# EAGLE design CPU_BOARD (EAGLE 7.3.0)
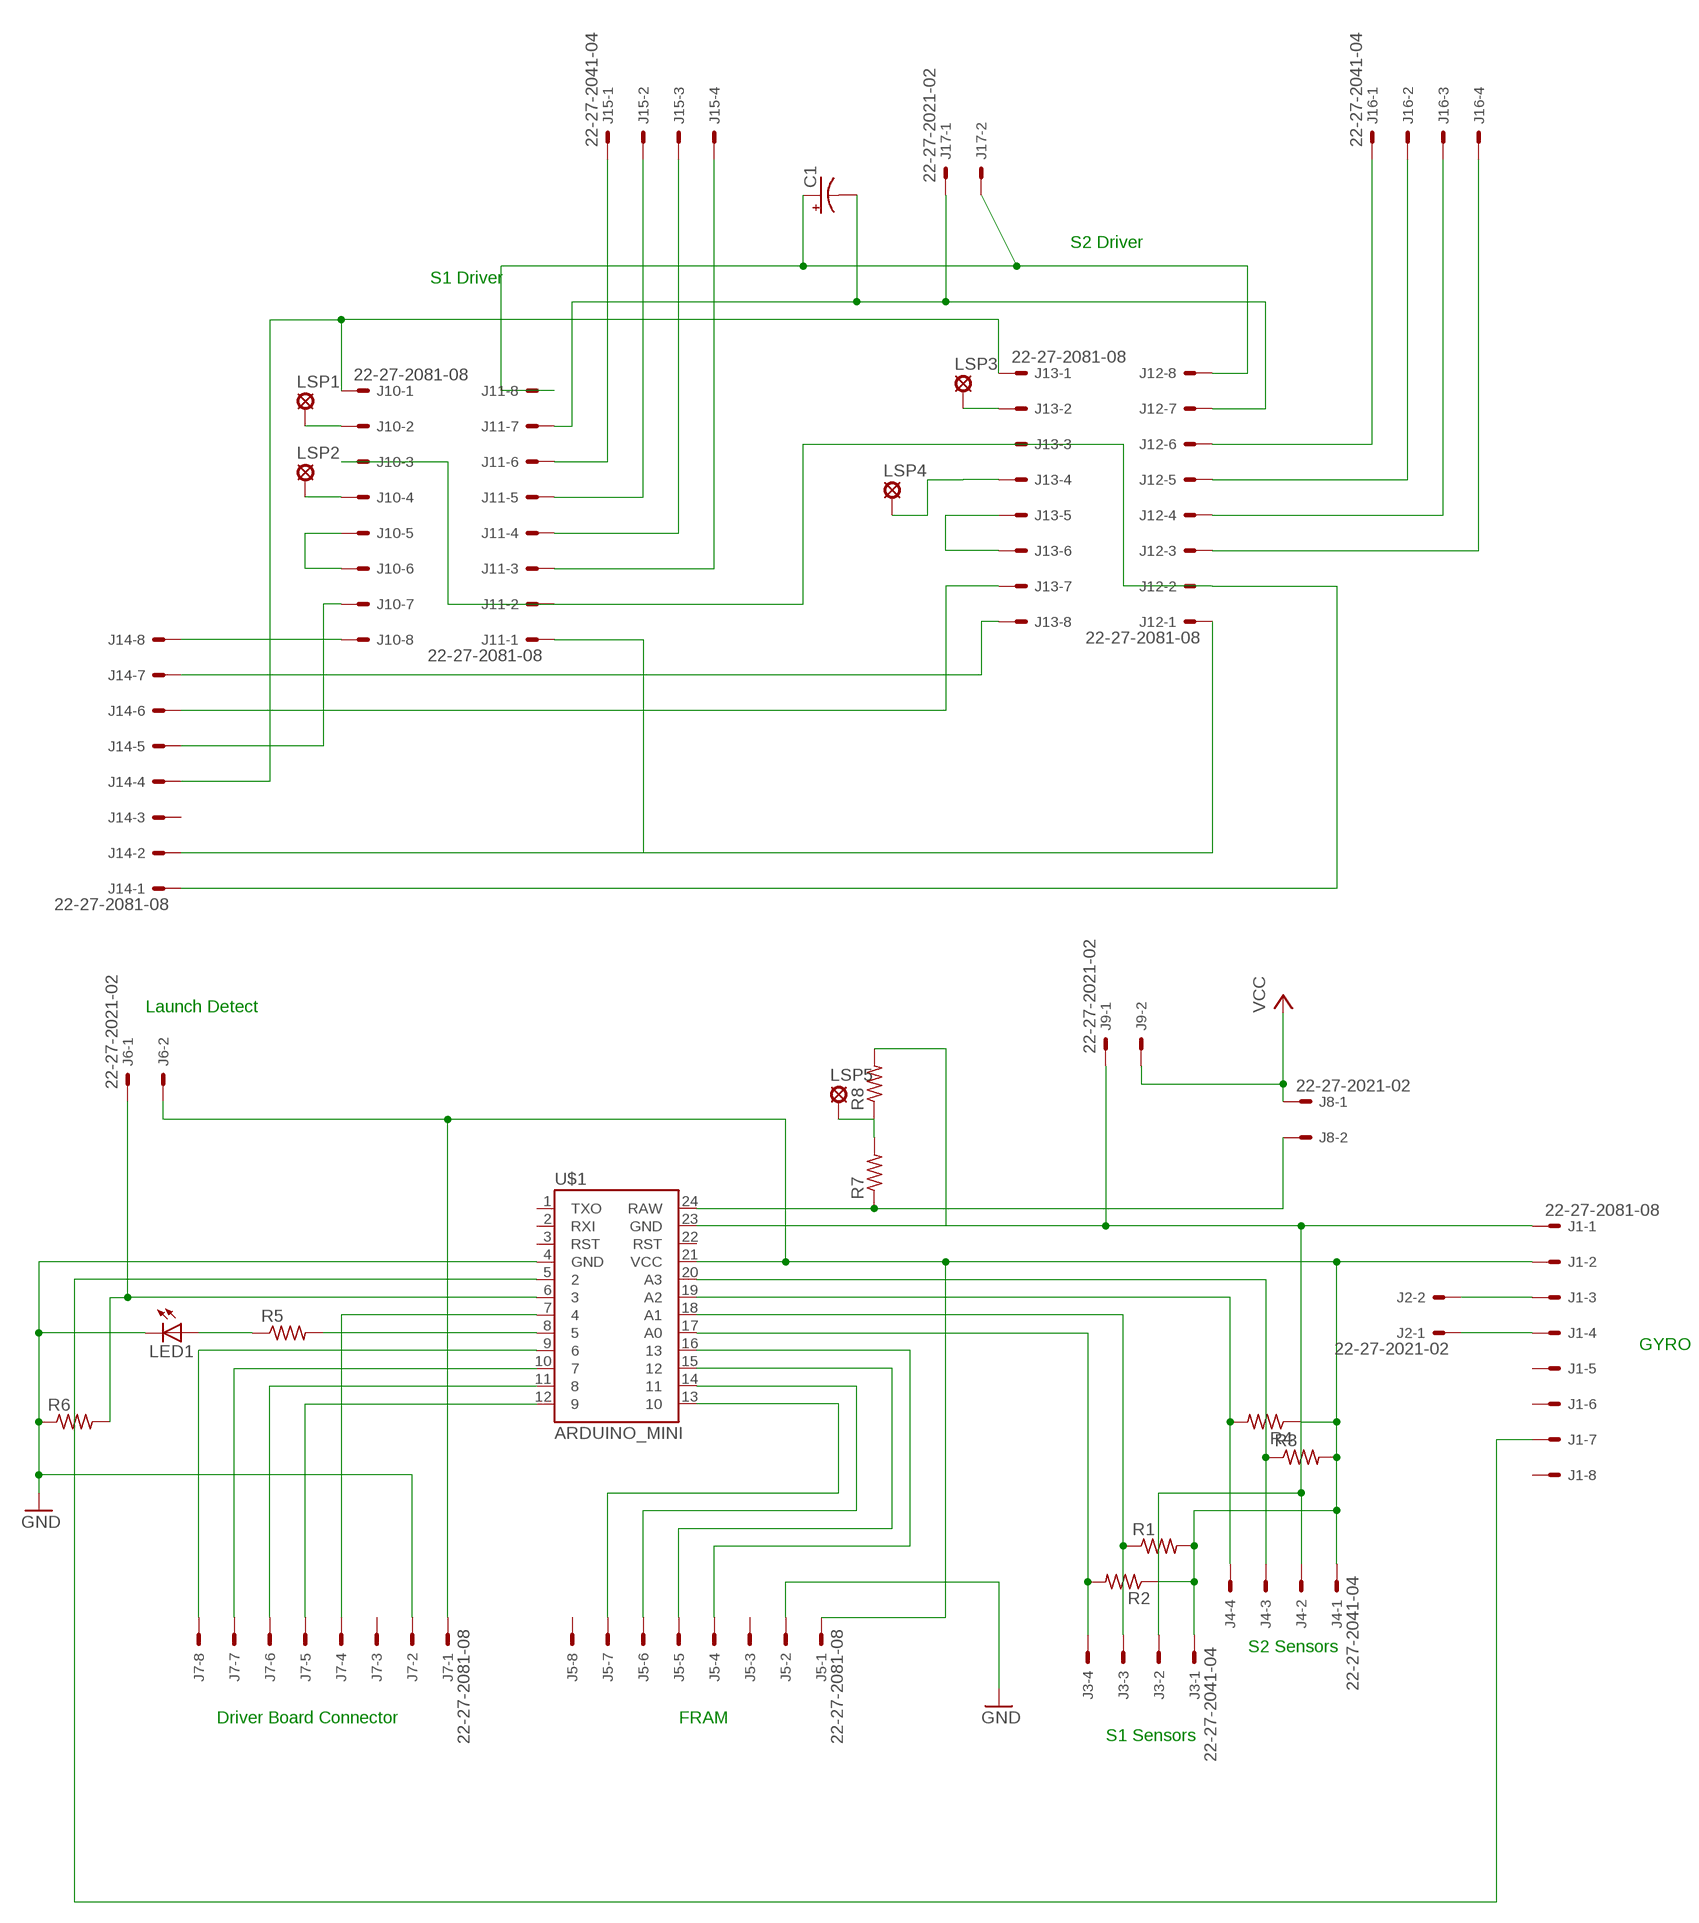
[diagram p0: schematic, sheet 1]

## Parts
C1  CPOL-USE2.5-7  [E2,5-7]
J1  22-27-2081-08  [6410-08]
J2  22-27-2021-02  [6410-02]
J3  22-27-2041-04  [6410-04]
J4  22-27-2041-04  [6410-04]
J5  22-27-2081-08  [6410-08]
J6  22-27-2021-02  [6410-02]
J7  22-27-2081-08  [6410-08]
J8  22-27-2021-02  [6410-02]
J9  22-27-2021-02  [6410-02]
J10  22-27-2081-08  [6410-08]
J11  22-27-2081-08  [6410-08]
J12  22-27-2081-08  [6410-08]
J13  22-27-2081-08  [6410-08]
J14  22-27-2081-08  [6410-08]
J15  22-27-2041-04  [6410-04]
J16  22-27-2041-04  [6410-04]
J17  22-27-2021-02  [6410-02]
LED1  LED5MM  [LED5MM]
LSP1  LSP10  [LSP10]
LSP2  LSP10  [LSP10]
LSP3  LSP10  [LSP10]
LSP4  LSP10  [LSP10]
LSP5  LSP11  [LSP11]
R1  R-US_0204/5  [0204/5]
R2  R-US_0204/5  [0204/5]
R3  R-US_0204/5  [0204/5]
R4  R-US_0204/5  [0204/5]
R5  R-US_0204/5  [0204/5]
R6  R-US_0204/5  [0204/5]
R7  R-US_0204/5  [0204/5]
R8  R-US_0204/5  [0204/5]
U$1  ARDUINO_MINI  [ARDUINO_MINI]

## Nets
GND: J5.2 J7.2 LED1.K(C) R6.1 U$1.4(GND)
N$1: J1.3 J2.2
N$2: J1.4 J2.1
N$3: J1.2 J3.1 J4.1 J5.1 J6.2 J7.1 R1.2 R2.1 R3.2 R4.1 U$1.21(VCC)
N$4: J10.5 J10.6
N$5: J8.2 R7.1 U$1.24(RAW)
N$6: J1.7 U$1.5
N$7: J5.7 U$1.13
N$8: J5.6 U$1.14
N$9: J4.3 R3.1 U$1.20(A3)
N$10: J4.4 R4.2 U$1.19(A2)
N$11: J3.3 R1.1 U$1.18(A1)
N$12: J3.4 R2.2 U$1.17(A0)
N$13: J5.5 U$1.15
N$14: J5.4 U$1.16
N$15: R5.2 U$1.8
N$16: LED1.A R5.1
N$17: J6.1 R6.2 U$1.6
N$18: J7.8 U$1.9
N$19: J13.5 J13.6
N$20: J7.7 U$1.10
N$21: J7.6 U$1.11
N$22: J7.5 U$1.12
N$23: J7.4 U$1.7
N$24: J1.1 J3.2 J4.2 J9.1 R8.2 U$1.23(GND)
N$25: J10.4 LSP2.MP
N$26: J10.8 J14.8
N$27: J10.7 J14.5
N$28: J13.7 J14.6
N$29: J13.8 J14.7
N$30: J10.2 LSP1.MP
N$31: C1.+ J11.8 J12.8 J17.2
N$32: J10.3 J11.2 J12.2 J13.3 J14.1
N$33: J11.1 J12.1 J14.2
N$34: C1.- J11.7 J12.7 J17.1
N$35: J10.1 J13.1 J14.4
N$36: J13.4 LSP4.MP
N$37: J11.6 J15.1
N$38: J11.5 J15.2
N$39: J11.4 J15.3
N$40: J11.3 J15.4
N$41: J12.6 J16.1
N$42: J12.5 J16.2
N$43: J12.4 J16.3
N$44: J12.3 J16.4
N$45: J13.2 LSP3.MP
N$47: LSP5.MP R7.2 R8.1
VCC: J8.1 J9.2
Unconnected: J1.5 J1.6 J1.8 J5.3 J5.8 J7.3 J14.3 U$1.1(TXO) U$1.2(RXI) U$1.3(RST) U$1.22(RST)

## Notes on the sheet
- S2 Driver
- S1 Driver
- Launch Detect
- GYRO
- S2 Sensors
- Driver Board Connector | FRAM
- S1 Sensors

## Library data of the parts
C1 = resistor:CPOL-US: POLARIZED CAPACITOR, American symbol
J1 J5 J7 J10-J14 = con-molex:22-?-08: CONNECTOR wire to board 2.54 mm (.1 inch) pitch header; OC_FARNELL: unknown; OC_NEWARK: unknown
J2 J6 J8 J9 J17 = con-molex:22-?-02: CONNECTOR wire to board 2.54 mm (.1 inch) pitch header; OC_FARNELL: unknown; OC_NEWARK: unknown
J3 J4 J15 J16 = con-molex:22-?-04: CONNECTOR wire to board 2.54 mm (.1 inch) pitch header; OC_FARNELL: unknown; OC_NEWARK: unknown
LED1 = led:LED: LED OSRAM: - CHIPLED LG R971, LG N971, LY N971, LG Q971, LY Q971, LO R971, LY R971 LH N974, LH R974 LS Q976, LO Q976, LY Q976 LO Q996 - Hyper CHIPLED LW Q18S LB Q993, LB Q99A, LB R99A - SideLED LS A670, LO A670, LY A670, LG A670, LP A670 LB A673, LV A673, LT A673, LW A673 LH A674 LY A675 LS A676, LA A676, LO A676, LY A676, LW A676 LS A679, LY A679, LG A679 - Hyper Micro SIDELED® LS Y876, LA Y876, LO Y876, LY Y876 LT Y87S - SmartLED LW L88C, LW L88S LB L89C, LB L89S, LG L890 LS L89K, LO L89K, LY L89K LS L896, LA L896, LO L896, LY L896 - TOPLED LS T670, LO T670, LY T670, LG T670, LP T670 LSG T670, LSP T670, LSY T670, LOP T670, LYG T670 LG T671, LOG T671, LSG T671 LB T673, LV T673, LT T673, LW T673 LH T674 LS T676, LA T676, LO T676, LY T676, LB T676, LH T676, LSB T676, LW T676 LB T67C, LV T67C, LT T67C, LS T67K, LO T67K, LY T67K, LW E67C LS E67B, LA E67B, LO E67B, LY E67B, LB E67C, LV E67C, LT E67C LW T67C LS T679, LY T679, LG T679 LS T770, LO T770, LY T770, LG T770, LP T770 LB T773, LV T773, LT T773, LW T773 LH T774 LS E675, LA E675, LY E675, LS T675 LS T776, LA T776, LO T776, LY T776, LB T776 LHGB T686 LT T68C, LB T68C - Hyper Mini TOPLED® LB M676 - Mini TOPLED Santana® LG M470 LS M47K, LO M47K, LY M47K Source: http://www.osram.convergy.de LUXEON: - LUMILED® LXK2-PW12-R00, LXK2-PW12-S00, LXK2-PW14-U00, LXK2-PW14-V00 LXK2-PM12-R00, LXK2-PM12-S00, LXK2-PM14-U00 LXK2-PE12-Q00, LXK2-PE12-R00, LXK2-PE12-S00, LXK2-PE14-T00, LXK2-PE14-U00 LXK2-PB12-K00, LXK2-PB12-L00, LXK2-PB12-M00, LXK2-PB14-N00, LXK2-PB14-P00, LXK2-PB14-Q00 LXK2-PR12-L00, LXK2-PR12-M00, LXK2-PR14-Q00, LXK2-PR14-R00 LXK2-PD12-Q00, LXK2-PD12-R00, LXK2-PD12-S00 LXK2-PH12-R00, LXK2-PH12-S00 LXK2-PL12-P00, LXK2-PL12-Q00, LXK2-PL12-R00 Source: www.luxeon.com KINGBRIGHT: KA-3528ASYC Source: www.kingbright.com
LSP1-LSP4 = solpad:LSP10: SOLDER PAD drill 1.0 mm, distributor Buerklin, 12H555
LSP5 = solpad:LSP11: SOLDER PAD drill 1.1 mm
R1-R4 R6-R8 = rcl:R-US_: RESISTOR, American symbol
R5 = resistor:R-US_: RESISTOR, American symbol
U$1 = Joe_SparkFun-Boards:ARDUINO_MINI: Arduino Pro Mini footprint

## Board
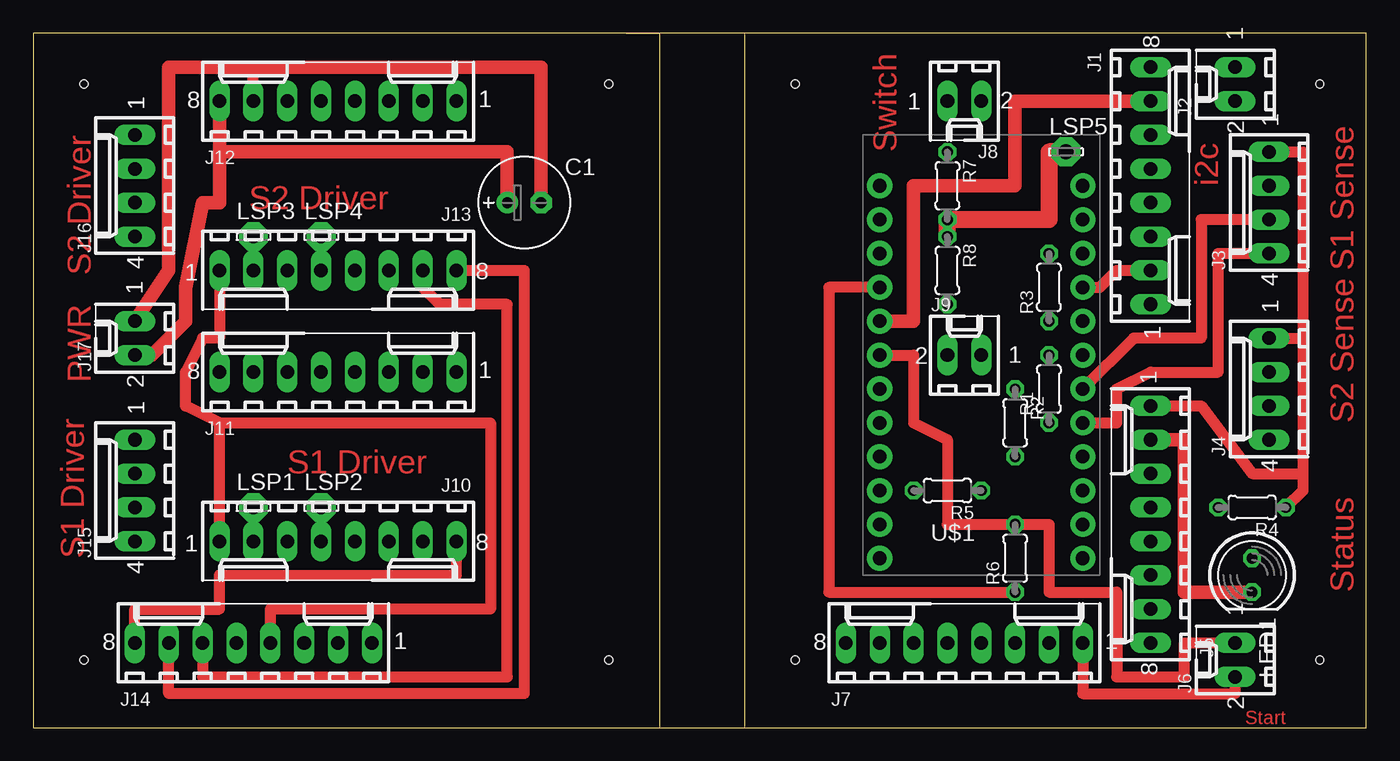
[diagram p1: board, top side]
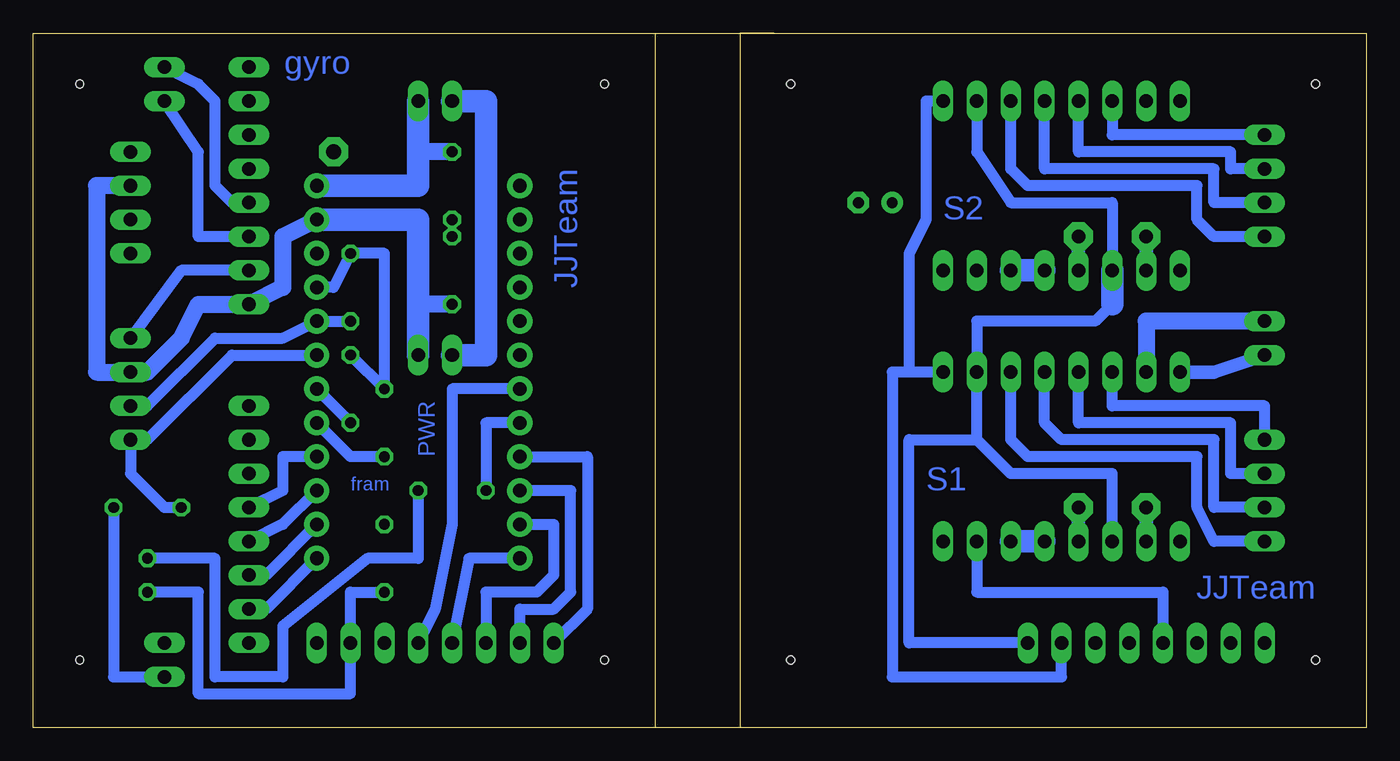
[diagram p2: board, bottom side, seen from below]

Size 100 x 52.07 mm. Coordinates in mm from the lower left corner, seen from the top.
Outline: 46.99,0 0,0 0,52.06 100,52.06 100,0 53.34,0
Outline: 46.99,0 53.34,0
Outline: 44.45,52.07 46.99,52.07 46.99,0
Outline: 53.34,52.07 53.34,0
Copper layers (1*16): Top 0.035mm / dielectric 1.5mm / Bottom 0.035mm
Design rules "default": minimum track width 10mil, minimum drill 24mil, track to track 8mil, track to pad 8mil, pad to pad 8mil, via to via 8mil, smd to smd 8mil, copper to edge 40mil, drill to drill 8mil, minimum pad ring 10mil, minimum via ring 8mil, stop-mask expansion 4mil, vias tented up to drill 0mil, thermal gap 10mil
Holes 0.6 mm at 3.81,5.08 57.15,5.08 43.18,5.08 96.52,5.08 96.52,48.26 57.15,48.26 43.18,48.26 3.81,48.26

### Footprints (pad centres in the part's own frame; a part is rotated, then mirrored left to right if it is on the bottom)
E2,5-7 = drill 0.813 pad 1.6: + -1.27,0 | drill 0.813 pad 1.6 octagon: - 1.27,0
6410-08 = drill 1.016 long: 1 8.89,0; 2 6.35,0; 3 3.81,0; 4 1.27,0; 5 -1.27,0; 6 -3.81,0; 7 -6.35,0; 8 -8.89,0
6410-02 = drill 1.016 long: 1 1.27,0; 2 -1.27,0
6410-04 = drill 1.016 long: 1 3.81,0; 2 1.27,0; 3 -1.27,0; 4 -3.81,0
LED5MM = drill 0.813 octagon: A -1.27,0; K 1.27,0
LSP10 = drill 1.016 pad 2.159 octagon: MP 0,0
LSP11 = drill 1.118 pad 2.159 octagon: MP 0,0
0204/5 = drill 0.813 octagon: 1 -2.54,0; 2 2.54,0
ARDUINO_MINI = drill 1.016 pad 1.88: 1 -7.62,12.7; 2 -7.62,10.16; 3 -7.62,7.62; 4 -7.62,5.08; 5 -7.62,2.54; 6 -7.62,0; 7 -7.62,-2.54; 8 -7.62,-5.08; 9 -7.62,-7.62; 10 -7.62,-10.16; 11 -7.62,-12.7; 12 -7.62,-15.24; 13 7.62,-15.24; 14 7.62,-12.7; 15 7.62,-10.16; 16 7.62,-7.62; 17 7.62,-5.08; 18 7.62,-2.54; 19 7.62,0; 20 7.62,2.54; 21 7.62,5.08; 22 7.62,7.62; 23 7.62,10.16; 24 7.62,12.7

### Placement (x,y rotation side)
C1  36.83,39.37 0 top
J1  83.82,40.64 270 top
J2  90.17,48.26 90 top
J3  92.71,39.37 90 top
J4  92.71,25.4 90 top
J5  83.82,15.24 90 top
J6  90.17,5.08 90 top
J7  69.85,6.35 0 top
J8  69.85,46.99 180 top
J9  69.85,27.94 0 top
J10  22.86,13.97 180 top
J11  22.86,26.67 0 top
J12  22.86,46.99 0 top
J13  22.86,34.29 180 top
J14  16.51,6.35 0 top
J15  7.62,17.78 90 top
J16  7.62,40.64 90 top
J17  7.62,29.21 90 top
LED1  91.44,11.43 270 top
LSP1  16.51,16.51 0 top
LSP2  21.59,16.51 0 top
LSP3  16.51,36.83 0 top
LSP4  21.59,36.83 0 top
LSP5  77.47,43.18 0 top
R1  76.2,25.4 90 top
R2  73.66,22.86 270 top
R3  76.2,33.02 90 top
R4  91.44,16.51 180 top
R5  68.58,17.78 180 top
R6  73.66,12.7 90 top
R7  68.58,40.64 270 top
R8  68.58,34.29 270 top
U$1  71.12,27.94 0 top

### Tracks (layer width: path | path; a pad name or v marks a point on that pad's centre or on a via)
GND
  Top 0.813: U$1.4 59.69,33.02 59.69,10.16 R6.1
  Top 1.016: J5.2 86.36,21.59 86.36,10.16 LED1.K
  Bottom 0.813: R6.1 76.2,10.16 J7.2 76.2,2.54 87.63,2.54 87.63,10.16 LED1.K
N$1
  Bottom 0.813: J1.3 87.63,36.83 87.63,43.18 J2.2
N$2
  Bottom 0.813: J1.4 85.09,39.37 86.36,40.64 86.36,46.99 87.63,48.26 J2.1
N$3  (via drill 0.6)
  Top 0.813: J7.1 78.74,2.54 90.17,2.54 J6.2 | J5.1 87.63,24.13 91.44,19.05 95.25,19.05 | U$1.21 80.01,33.02 81.28,34.29 J1.2 | J4.1 95.25,29.21 | 95.25,29.21 95.25,19.05 | 95.25,19.05 95.25,17.78 R4.1 | J3.1 95.25,43.18 95.25,29.21
  Bottom 0.813: U$1.21 77.47,33.02 R3.2 73.66,35.56 R2.1 R1.2 | R4.1 93.98,3.81 J6.2 | J1.2 88.9,34.29 J4.1
  other vias: 83.82,34.29 92.71,29.21
N$4
  Bottom 1.676: J10.5 J10.6
N$5
  Bottom 1.27: R7.1 71.12,43.18
  Bottom 1.676: J8.2 71.12,43.18 71.12,40.64 U$1.24
N$6
  Top 1.016: J1.7 73.66,46.99 73.66,40.64 66.04,40.64 66.04,30.48 U$1.5
N$7
  Bottom 0.813: U$1.13 82.55,8.89 J5.7
N$8
  Bottom 0.813: U$1.14 82.55,11.43 J5.6
N$9
  Bottom 0.813: J4.3 91.44,24.13 86.36,29.21 81.28,29.21 U$1.20 R3.1
N$10
  Bottom 0.813: R4.2 90.17,16.51 92.71,19.05 J4.4 91.44,21.59 85.09,27.94 U$1.19
N$11
  Top 0.813: J3.3 87.63,38.1 87.63,29.21 82.55,29.21 U$1.18
  Bottom 0.813: R1.1 U$1.18
N$12
  Top 0.813: U$1.17 81.28,22.86 81.28,25.4 83.82,26.67 88.9,26.67 88.9,35.56 J3.4
  Bottom 0.813: R2.2 76.2,20.32 U$1.17
N$13
  Bottom 0.813: U$1.15 81.28,15.24 J5.5
N$14
  Bottom 0.813: U$1.16 81.28,20.32 81.28,17.78 J5.4
N$15
  Bottom 0.813: U$1.8 66.04,22.86 R5.2
N$16
  Bottom 0.813: R5.1 71.12,12.7 74.93,12.7 81.28,7.62 81.28,3.81 86.36,3.81 86.36,12.7 LED1.A
N$17
  Top 0.813: U$1.6 66.04,27.94 66.04,22.86 68.58,21.59 68.58,15.24 R6.2 76.2,15.24 76.2,10.16 81.28,10.16 81.28,3.81 86.36,3.81 86.36,6.35 J6.1
N$18
  Bottom 0.813: U$1.9 58.42,20.32 58.42,8.89 J7.8
N$19
  Bottom 1.676: J13.5 J13.6
N$20
  Bottom 0.813: J7.7 63.5,8.89 60.96,8.89 59.69,10.16 59.69,17.78 U$1.10
N$21
  Bottom 0.813: U$1.11 60.96,15.24 60.96,11.43 62.23,10.16 66.04,10.16 J7.6
N$22
  Bottom 0.813: U$1.12 67.31,12.7 J7.5
N$23
  Bottom 0.813: U$1.7 68.58,25.4 68.58,15.24 69.85,8.89 J7.4
N$24
  Bottom 1.27: J3.2 95.25,40.64 95.25,26.67 J4.2 91.44,26.67 88.9,29.21 87.63,31.75 J1.1 81.28,33.02 81.28,36.83 U$1.23 | R8.2 71.12,31.75
  Bottom 1.676: J9.1 71.12,31.75 71.12,38.1 U$1.23
N$25
  Bottom 1.016: J10.4 LSP2.MP
N$26
  Top 0.813: J14.8 7.62,8.89 13.97,8.89 13.97,11.43 31.75,11.43 J10.8
N$27
  Bottom 0.813: J10.7 29.21,10.16 15.24,10.16 J14.5
N$28
  Top 0.406: 29.21,33.02 J13.7
  Top 0.813: J14.6 12.7,3.81 35.56,3.81 35.56,31.75 30.48,31.75 29.21,33.02
N$29
  Top 0.813: J13.8 36.83,34.29 36.83,2.54 10.16,2.54 J14.7
N$30
  Bottom 1.016: J10.2 LSP1.MP
N$31
  Top 1.016: 13.97,43.18 13.97,39.37 12.7,39.37 11.43,33.02 11.43,30.48 8.89,27.94 J17.2 | J12.8 13.97,43.18 | 13.97,43.18 35.56,43.18 C1.+
  Bottom 1.016: J11.8 11.43,26.67 J17.2
N$32
  Bottom 0.406: J10.3 19.05,15.24
  Bottom 0.813: J12.2 29.21,43.18 26.67,39.37 19.05,39.37 J13.3 | 19.05,31.75 20.32,30.48 29.21,30.48 J11.2 29.21,21.59 | 19.05,15.24 19.05,19.05 26.67,19.05 29.21,21.59 | J14.1 34.29,6.35 34.29,21.59 29.21,21.59
  Bottom 1.676: J13.3 19.05,31.75
N$33
  Bottom 0.813: J12.1 33.02,46.99 33.02,38.1 34.29,35.56 34.29,26.67 | J11.1 34.29,26.67 | 34.29,26.67 35.56,26.67 35.56,3.81 22.86,3.81 J14.2
N$34
  Top 0.813: J12.7 16.51,49.53
  Top 1.016: J17.1 10.16,34.29 10.16,49.53 16.51,49.53 38.1,49.53 C1.-
  Bottom 1.27: J17.1 16.51,30.48 J11.7
N$35
  Top 0.813: J13.1 13.97,29.21 12.7,29.21 11.43,26.67 11.43,24.13 13.97,22.86 | J10.1 13.97,22.86 | 13.97,22.86 34.29,22.86 34.29,8.89 17.78,8.89 J14.4
N$36
  Bottom 1.016: J13.4 LSP4.MP
N$37
  Bottom 0.813: J15.1 7.62,24.13 19.05,24.13 J11.6
N$38
  Bottom 0.813: J15.2 10.16,19.05 10.16,22.86 21.59,22.86 J11.5
N$39
  Bottom 0.813: J15.3 11.43,16.51 11.43,21.59 22.86,21.59 24.13,22.86 J11.4
N$40
  Bottom 0.813: J15.4 11.43,13.97 12.7,16.51 12.7,20.32 25.4,20.32 26.67,21.59 J11.3
N$41
  Bottom 0.813: J16.1 19.05,44.45 J12.6
N$42
  Bottom 0.813: J16.2 10.16,41.91 10.16,43.18 21.59,43.18 J12.5
N$43
  Bottom 0.813: J16.3 11.43,39.37 11.43,41.91 24.13,41.91 J12.4
N$44
  Bottom 0.813: J16.4 11.43,36.83 12.7,38.1 12.7,40.64 25.4,40.64 26.67,41.91 J12.3
N$45
  Bottom 1.016: LSP3.MP J13.2
N$47
  Top 1.27: LSP5.MP 76.2,43.18 76.2,38.1 R7.2 R8.1
VCC
  Bottom 1.676: J8.1 66.04,46.99 66.04,27.94 J9.2

### Text on the board
Top: S2 Driver | Switch | S2 Driver | i2c | S1 Sense | PWR | S2 Sense | S1 Driver | S1 Driver | Status | Start
Bottom: gyro | JJTeam | S2 | PWR | S1 | fram | JJTeam